# Altium project ts_20-Terminal-Board-R0.PrjPcb
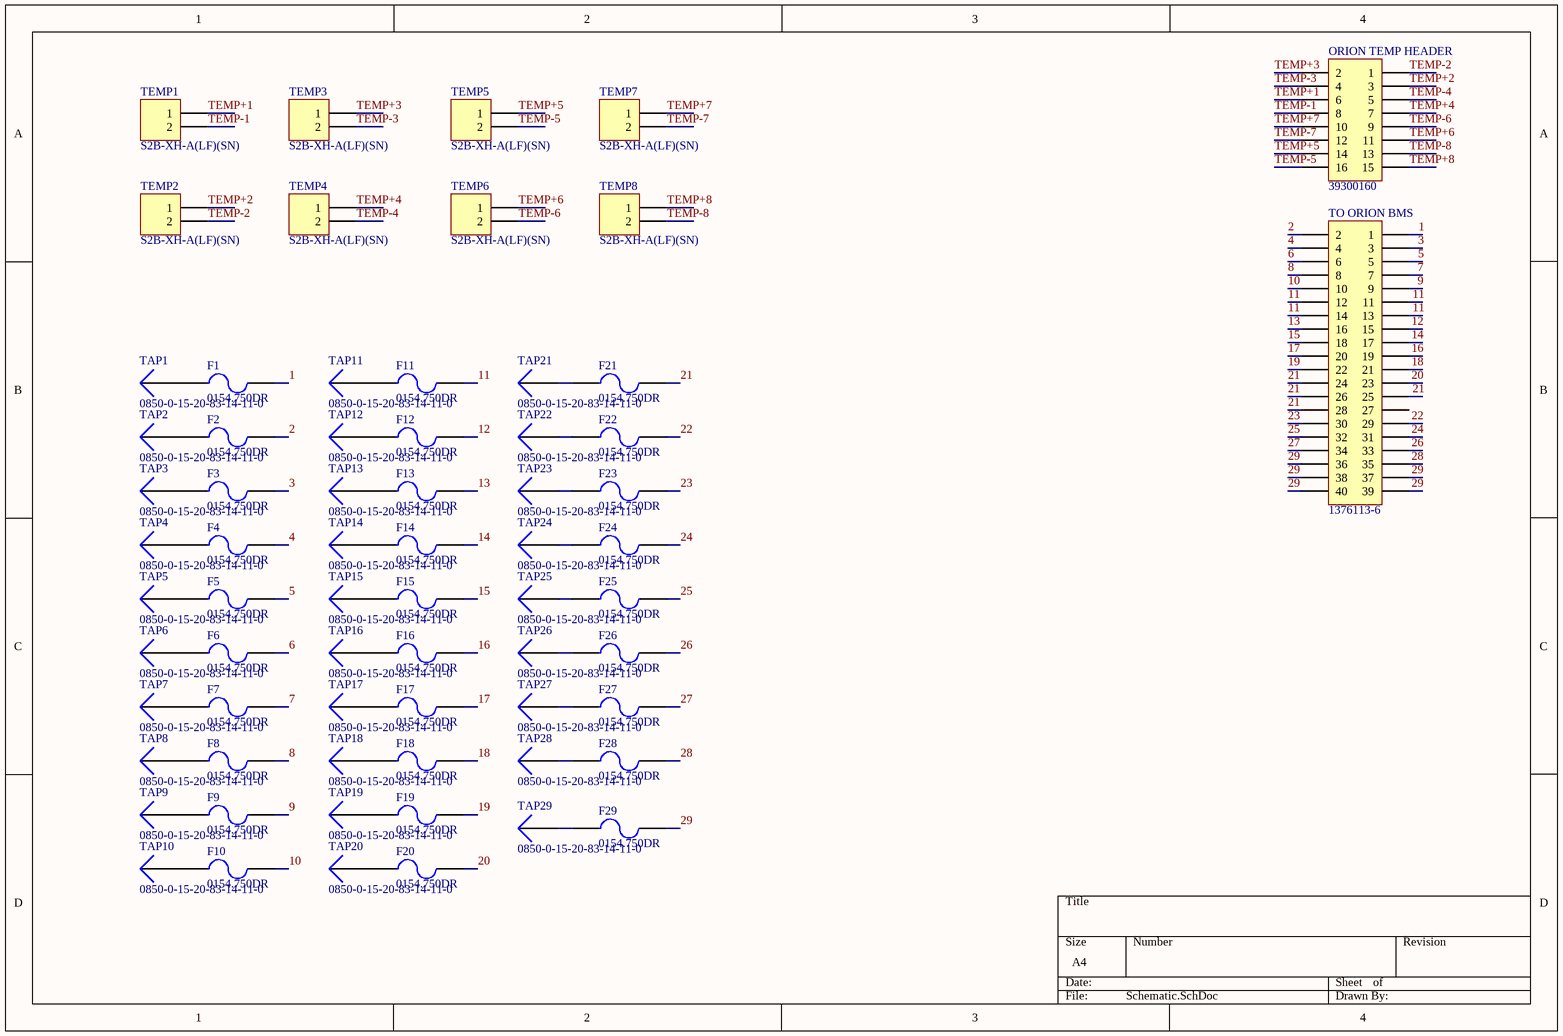
[diagram p0: Schematic.SchDoc]
1 sheet, 68 parts. Net scope: global (net labels, ports and power ports of the same name join across sheets).
Board file: PCB.PcbDoc

## Sheet Schematic.SchDoc
size A4

### Parts
F1  0154.750DR  [Omni BLOK 0154]
F2  0154.750DR  [Omni BLOK 0154]
F3  0154.750DR  [Omni BLOK 0154]
F4  0154.750DR  [Omni BLOK 0154]
F5  0154.750DR  [Omni BLOK 0154]
F6  0154.750DR  [Omni BLOK 0154]
F7  0154.750DR  [Omni BLOK 0154]
F8  0154.750DR  [Omni BLOK 0154]
F9  0154.750DR  [Omni BLOK 0154]
F10  0154.750DR  [Omni BLOK 0154]
F11  0154.750DR  [Omni BLOK 0154]
F12  0154.750DR  [Omni BLOK 0154]
F13  0154.750DR  [Omni BLOK 0154]
F14  0154.750DR  [Omni BLOK 0154]
F15  0154.750DR  [Omni BLOK 0154]
F16  0154.750DR  [Omni BLOK 0154]
F17  0154.750DR  [Omni BLOK 0154]
F18  0154.750DR  [Omni BLOK 0154]
F19  0154.750DR  [Omni BLOK 0154]
F20  0154.750DR  [Omni BLOK 0154]
F21  0154.750DR  [Omni BLOK 0154]
F22  0154.750DR  [Omni BLOK 0154]
F23  0154.750DR  [Omni BLOK 0154]
F24  0154.750DR  [Omni BLOK 0154]
F25  0154.750DR  [Omni BLOK 0154]
F26  0154.750DR  [Omni BLOK 0154]
F27  0154.750DR  [Omni BLOK 0154]
F28  0154.750DR  [Omni BLOK 0154]
F29  0154.750DR  [Omni BLOK 0154]
ORION_TEMP_HEADER  39300160  [39300160]
TAP1  0850-0-15-20-83-14-11-0  [0850-0-15-20-83-14-11-0]
TAP2  0850-0-15-20-83-14-11-0  [0850-0-15-20-83-14-11-0]
TAP3  0850-0-15-20-83-14-11-0  [0850-0-15-20-83-14-11-0]
TAP4  0850-0-15-20-83-14-11-0  [0850-0-15-20-83-14-11-0]
TAP5  0850-0-15-20-83-14-11-0  [0850-0-15-20-83-14-11-0]
TAP6  0850-0-15-20-83-14-11-0  [0850-0-15-20-83-14-11-0]
TAP7  0850-0-15-20-83-14-11-0  [0850-0-15-20-83-14-11-0]
TAP8  0850-0-15-20-83-14-11-0  [0850-0-15-20-83-14-11-0]
TAP9  0850-0-15-20-83-14-11-0  [0850-0-15-20-83-14-11-0]
TAP10  0850-0-15-20-83-14-11-0  [0850-0-15-20-83-14-11-0]
TAP11  0850-0-15-20-83-14-11-0  [0850-0-15-20-83-14-11-0]
TAP12  0850-0-15-20-83-14-11-0  [0850-0-15-20-83-14-11-0]
TAP13  0850-0-15-20-83-14-11-0  [0850-0-15-20-83-14-11-0]
TAP14  0850-0-15-20-83-14-11-0  [0850-0-15-20-83-14-11-0]
TAP15  0850-0-15-20-83-14-11-0  [0850-0-15-20-83-14-11-0]
TAP16  0850-0-15-20-83-14-11-0  [0850-0-15-20-83-14-11-0]
TAP17  0850-0-15-20-83-14-11-0  [0850-0-15-20-83-14-11-0]
TAP18  0850-0-15-20-83-14-11-0  [0850-0-15-20-83-14-11-0]
TAP19  0850-0-15-20-83-14-11-0  [0850-0-15-20-83-14-11-0]
TAP20  0850-0-15-20-83-14-11-0  [0850-0-15-20-83-14-11-0]
TAP21  0850-0-15-20-83-14-11-0  [0850-0-15-20-83-14-11-0]
TAP22  0850-0-15-20-83-14-11-0  [0850-0-15-20-83-14-11-0]
TAP23  0850-0-15-20-83-14-11-0  [0850-0-15-20-83-14-11-0]
TAP24  0850-0-15-20-83-14-11-0  [0850-0-15-20-83-14-11-0]
TAP25  0850-0-15-20-83-14-11-0  [0850-0-15-20-83-14-11-0]
TAP26  0850-0-15-20-83-14-11-0  [0850-0-15-20-83-14-11-0]
TAP27  0850-0-15-20-83-14-11-0  [0850-0-15-20-83-14-11-0]
TAP28  0850-0-15-20-83-14-11-0  [0850-0-15-20-83-14-11-0]
TAP29  0850-0-15-20-83-14-11-0  [0850-0-15-20-83-14-11-0]
TEMP1  S2B-XH-A(LF)(SN)
TEMP2  S2B-XH-A(LF)(SN)
TEMP3  S2B-XH-A(LF)(SN)
TEMP4  S2B-XH-A(LF)(SN)
TEMP5  S2B-XH-A(LF)(SN)
TEMP6  S2B-XH-A(LF)(SN)
TEMP7  S2B-XH-A(LF)(SN)
TEMP8  S2B-XH-A(LF)(SN)
TO_ORION_BMS  1376113-6  [1376113-6]

### Nets
1: F1.2 TO_ORION_BMS.1
2: F2.2 TO_ORION_BMS.2
3: F3.2 TO_ORION_BMS.3
4: F4.2 TO_ORION_BMS.4
5: F5.2 TO_ORION_BMS.5
6: F6.2 TO_ORION_BMS.6
7: F7.2 TO_ORION_BMS.7
8: F8.2 TO_ORION_BMS.8
9: F9.2 TO_ORION_BMS.9
10: F10.2 TO_ORION_BMS.10
11: F11.2 TO_ORION_BMS.11 TO_ORION_BMS.12 TO_ORION_BMS.13 TO_ORION_BMS.14
12: F12.2 TO_ORION_BMS.15
13: F13.2 TO_ORION_BMS.16
14: F14.2 TO_ORION_BMS.17
15: F15.2 TO_ORION_BMS.18
16: F16.2 TO_ORION_BMS.19
17: F17.2 TO_ORION_BMS.20
18: F18.2 TO_ORION_BMS.21
19: F19.2 TO_ORION_BMS.22
20: F20.2 TO_ORION_BMS.23
21: F21.2 TO_ORION_BMS.24 TO_ORION_BMS.25 TO_ORION_BMS.26 TO_ORION_BMS.28
22: F22.2 TO_ORION_BMS.29
23: F23.2 TO_ORION_BMS.30
24: F24.2 TO_ORION_BMS.31
25: F25.2 TO_ORION_BMS.32
26: F26.2 TO_ORION_BMS.33
27: F27.2 TO_ORION_BMS.34
28: F28.2 TO_ORION_BMS.35
29: F29.2 TO_ORION_BMS.36 TO_ORION_BMS.37 TO_ORION_BMS.38 TO_ORION_BMS.39 TO_ORION_BMS.40
TEMP+1: ORION_TEMP_HEADER.6 TEMP1.1
TEMP+2: ORION_TEMP_HEADER.3 TEMP2.1
TEMP+3: ORION_TEMP_HEADER.2 TEMP3.1
TEMP+4: ORION_TEMP_HEADER.7 TEMP4.1
TEMP+5: ORION_TEMP_HEADER.14 TEMP5.1
TEMP+6: ORION_TEMP_HEADER.11 TEMP6.1
TEMP+7: ORION_TEMP_HEADER.10 TEMP7.1
TEMP+8: ORION_TEMP_HEADER.15 TEMP8.1
TEMP-1: ORION_TEMP_HEADER.8 TEMP1.2
TEMP-2: ORION_TEMP_HEADER.1 TEMP2.2
TEMP-3: ORION_TEMP_HEADER.4 TEMP3.2
TEMP-4: ORION_TEMP_HEADER.5 TEMP4.2
TEMP-5: ORION_TEMP_HEADER.16 TEMP5.2
TEMP-6: ORION_TEMP_HEADER.9 TEMP6.2
TEMP-7: ORION_TEMP_HEADER.12 TEMP7.2
TEMP-8: ORION_TEMP_HEADER.13 TEMP8.2
NetF1_1: F1.1 TAP1.1(="part_number")
NetF2_1: F2.1 TAP2.1(="part_number")
NetF3_1: F3.1 TAP3.1(="part_number")
NetF4_1: F4.1 TAP4.1(="part_number")
NetF5_1: F5.1 TAP5.1(="part_number")
NetF6_1: F6.1 TAP6.1(="part_number")
NetF7_1: F7.1 TAP7.1(="part_number")
NetF8_1: F8.1 TAP8.1(="part_number")
NetF9_1: F9.1 TAP9.1(="part_number")
NetF10_1: F10.1 TAP10.1(="part_number")
NetF11_1: F11.1 TAP11.1(="part_number")
NetF12_1: F12.1 TAP12.1(="part_number")
NetF13_1: F13.1 TAP13.1(="part_number")
NetF14_1: F14.1 TAP14.1(="part_number")
NetF15_1: F15.1 TAP15.1(="part_number")
NetF16_1: F16.1 TAP16.1(="part_number")
NetF17_1: F17.1 TAP17.1(="part_number")
NetF18_1: F18.1 TAP18.1(="part_number")
NetF19_1: F19.1 TAP19.1(="part_number")
NetF20_1: F20.1 TAP20.1(="part_number")
NetF21_1: F21.1 TAP21.1(="part_number")
NetF22_1: F22.1 TAP22.1(="part_number")
NetF23_1: F23.1 TAP23.1(="part_number")
NetF24_1: F24.1 TAP24.1(="part_number")
NetF25_1: F25.1 TAP25.1(="part_number")
NetF26_1: F26.1 TAP26.1(="part_number")
NetF27_1: F27.1 TAP27.1(="part_number")
NetF28_1: F28.1 TAP28.1(="part_number")
NetF29_1: F29.1 TAP29.1(="part_number")

Not connected (* = marked no-connect by the designer): TO_ORION_BMS 27

### Library data of the parts
F1-F29 = 0154.750DR: FUSE BOARD MNT 750MA 125VAC/VDC; Manufacturer: LittelFuse Inc; Part Number: 0154.750DR; Digikey Part Number: F1221CT-ND; Digikey Link: https://www.digikey.com/product-detail/en/littelfuse-inc/0154.750DR/F1221CT-ND/183370
ORION_TEMP_HEADER = 39300160: Positions: 16; Pitch: 4.2mm; Row Spacing: 5.5mm; Angle: 90; Flange: No; Contact: Tin; Part Number: 39300160; Digikey Part Number: WM21358-ND
TAP1-TAP29 = 0850-0-15-20-83-14-11-0: Positions: 1; Pitch: NA; Angle: 90; Contact: Gold; Part Number: 0850-0-15-20-83-14-11-0; Row Spacing: NA; Flange: NA; Digikey Part Number: ED90436-ND; Digikey Link: https://www.digikey.com.au/products/en?keywords=0850-0-15-20-83-14-11-0
TO_ORION_BMS = 1376113-6: Positions: 40; Pitch: 2.2; Row Spacing: 3; Angle: 0; Contact: gold; Part Number: 1376113-6; Digikey Part Number: A122206-ND; Digikey Link: https://www.digikey.com.au/product-detail/en/te-connectivity-amp-connectors/1376113-2/A122206-ND/2273530